# Altium project RK_NVR_DEMO1_RK3588_LP4XD200P232SD8_V21_20211228.PrjPcb (part 10 of 19)

## Sheet 40.Flash-eMMC Flash.SchDoc
size 297 x 209 mm; Revision: V2.1; Schematic Page Number: 11; Page Number: 25; Check: Default; Schematic Name: RK_NVR_DEMO1_RK3588_LP4/4x_V21; Page Count: 43; Page name: 40.Flash-eMMC Flash; Designer: Zhangdz; Schematic Page Count: 99; Revcode: V2.1; DsnPath: E:\Work\SBER\RK3588_SOM\temp\RK_NVR_DEMO1_RK3588_LP4XD200P232SD8_V21_20211228.DSN; SchematicName: RK_NVR_DEMO1_RK3588_LP4/4x_V21; PageName: 40.Flash-eMMC Flash; PageSize: A4; TopSchematic: True
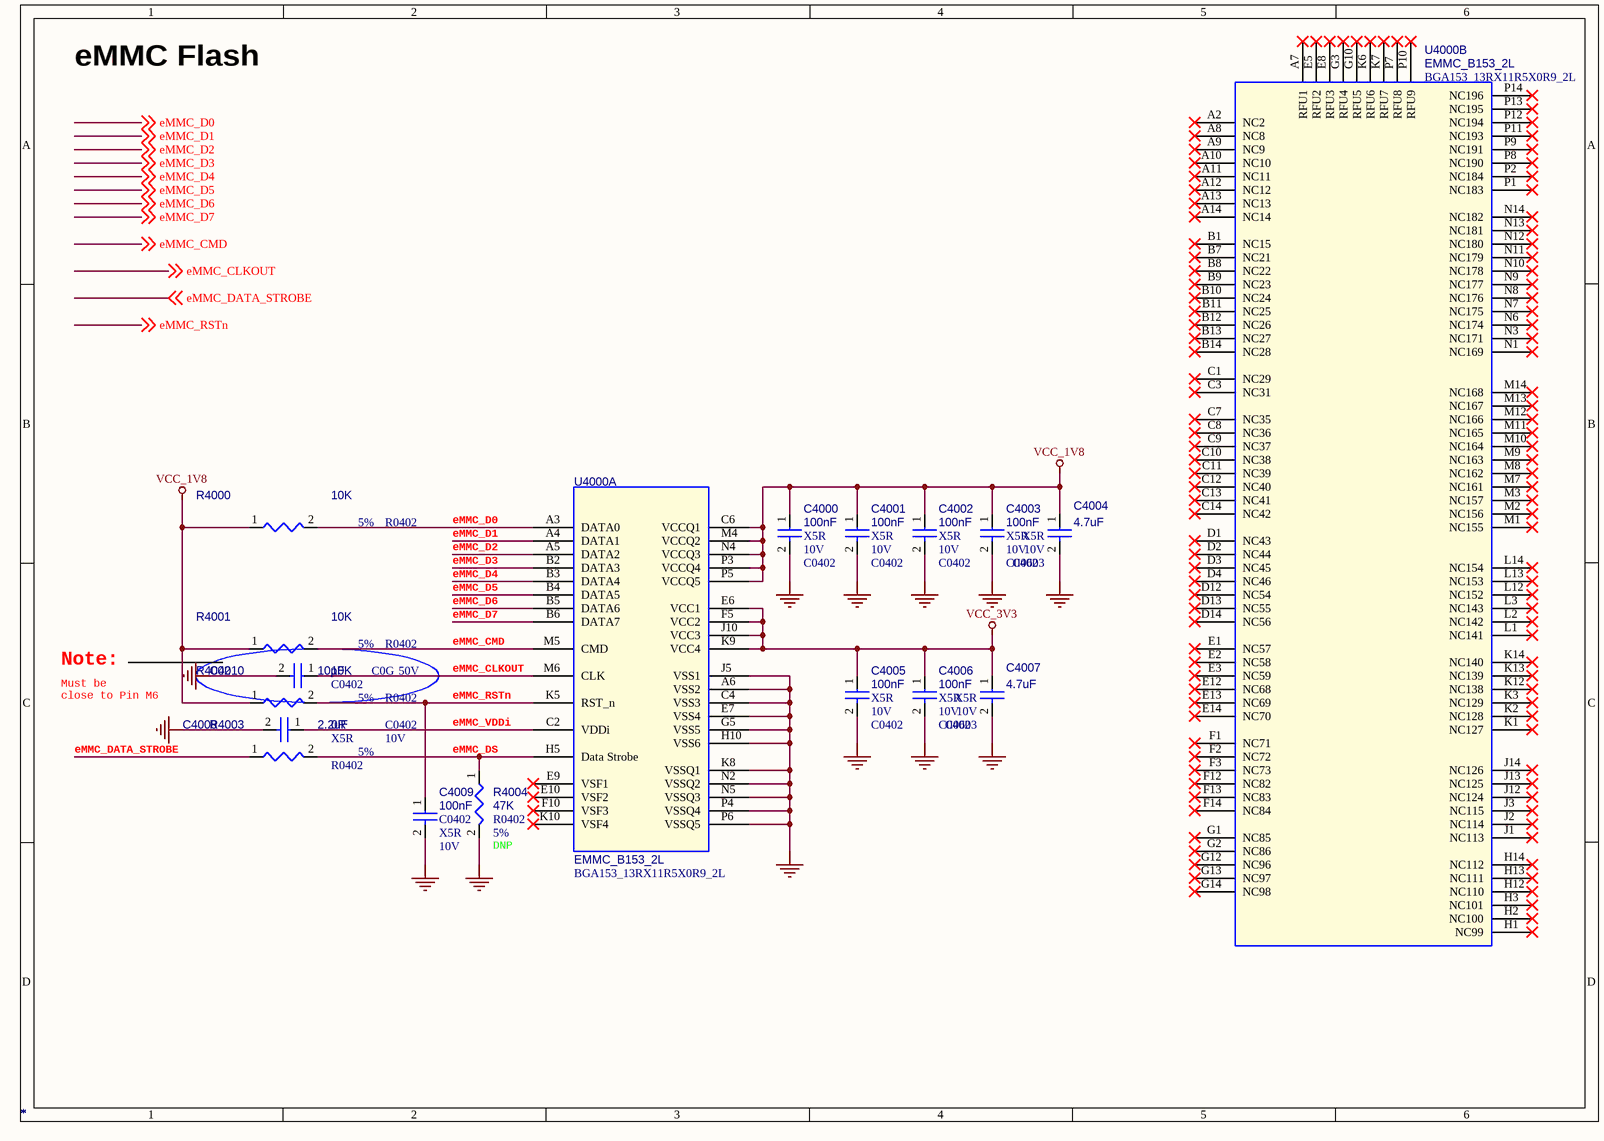
[diagram p52: 40.Flash-eMMC Flash.SchDoc]

### Parts
C4000  *  Voltage: 10V  Dielectric: X5R  [C0402]
C4001  *  Voltage: 10V  Dielectric: X5R  [C0402]
C4002  *  Voltage: 10V  Dielectric: X5R  [C0402]
C4003  *  Voltage: 10V  Dielectric: X5R  [C0402]
C4004  *  Voltage: 10V  Dielectric: X5R  [C0603]
C4005  *  Voltage: 10V  Dielectric: X5R  [C0402]
C4006  *  Voltage: 10V  Dielectric: X5R  [C0402]
C4007  *  Voltage: 10V  Dielectric: X5R  [C0603]
C4008  *  Voltage: 10V  Dielectric: X5R  [C0402]
C4009  *  Voltage: 10V  Dielectric: X5R  [C0402]
C4010  *  Voltage: 50V  Dielectric: C0G  [C0402]
R4000  *  Tolerance: 5%  [R0402]
R4001  *  Tolerance: 5%  [R0402]
R4002  *  Tolerance: 5%  [R0402]
R4003  *  Tolerance: 5%  [R0402]
R4004  *  Tolerance: 5%  option: DNP  [R0402]
U4000  *  [BGA153_13RX11R5X0R9_2L]  (parts A,B of 2)

### Nets
GND: C4000.2 C4001.2 C4002.2 C4003.2 C4004.2 C4005.2 C4006.2 C4007.2 C4008.2 C4009.2 C4010.2 R4004.2 U4000.A6(VSS2) U4000.C4(VSS3) U4000.E7(VSS4) U4000.G5(VSS5) U4000.H10(VSS6) U4000.J5(VSS1) U4000.K8(VSSQ1) U4000.N2(VSSQ2) U4000.N5(VSSQ3) U4000.P4(VSSQ4) U4000.P6(VSSQ5)
VCC_1V8: C4000.1 C4001.1 C4002.1 C4003.1 C4004.1 R4000.1 R4001.1 R4002.1 U4000.C6(VCCQ1) U4000.M4(VCCQ2) U4000.N4(VCCQ3) U4000.P3(VCCQ4) U4000.P5(VCCQ5)
VCC_3V3: C4005.1 C4006.1 C4007.1 U4000.E6(VCC1) U4000.F5(VCC2) U4000.J10(VCC3) U4000.K9(VCC4)
eMMC_CLKOUT: C4010.1 U4000.M6(CLK) ; off-sheet eMMC_CLKOUT
eMMC_CMD: R4001.2 U4000.M5(CMD) ; off-sheet eMMC_CMD
eMMC_D0: R4000.2 U4000.A3(DATA0) ; off-sheet eMMC_D0
eMMC_D1: U4000.A4(DATA1) ; off-sheet eMMC_D1
eMMC_D2: U4000.A5(DATA2) ; off-sheet eMMC_D2
eMMC_D3: U4000.B2(DATA3) ; off-sheet eMMC_D3
eMMC_D4: U4000.B3(DATA4) ; off-sheet eMMC_D4
eMMC_D5: U4000.B4(DATA5) ; off-sheet eMMC_D5
eMMC_D6: U4000.B5(DATA6) ; off-sheet eMMC_D6
eMMC_D7: U4000.B6(DATA7) ; off-sheet eMMC_D7
eMMC_DATA_STROBE: R4003.1 ; off-sheet eMMC_DATA_STROBE
eMMC_DS: R4003.2 R4004.1 U4000.H5(Data_Strobe)
eMMC_RSTn: C4009.1 R4002.2 U4000.K5(RST_n) ; off-sheet eMMC_RSTn
eMMC_VDDi: C4008.1 U4000.C2(VDDi)

Not connected (* = marked no-connect by the designer): U4000 A2(NC2)* A7(RFU1)* A8(NC8)* A9(NC9)* A10(NC10)* A11(NC11)* A12(NC12)* A13(NC13)* A14(NC14)* B1(NC15)* B7(NC21)* B8(NC22)* B9(NC23)* B10(NC24)* B11(NC25)* B12(NC26)* B13(NC27)* B14(NC28)* C1(NC29)* C3(NC31)* C7(NC35)* C8(NC36)* C9(NC37)* C10(NC38)* C11(NC39)* C12(NC40)* C13(NC41)* C14(NC42)* D1(NC43)* D2(NC44)* D3(NC45)* D4(NC46)* D12(NC54)* D13(NC55)* D14(NC56)* E1(NC57)* E2(NC58)* E3(NC59)* E5(RFU2)* E8(RFU3)* E9(VSF1)* E10(VSF2)* E12(NC68)* E13(NC69)* E14(NC70)* F1(NC71)* F2(NC72)* F3(NC73)* F10(VSF3)* F12(NC82)* F13(NC83)* F14(NC84)* G1(NC85)* G2(NC86)* G3(RFU4)* G10(RFU5)* G12(NC96)* G13(NC97)* G14(NC98)* H1(NC99)* H2(NC100)* H3(NC101)* H12(NC110)* H13(NC111)* H14(NC112)* J1(NC113)* J2(NC114)* J3(NC115)* J12(NC124)* J13(NC125)* J14(NC126)* K1(NC127)* K2(NC128)* K3(NC129)* K6(RFU6)* K7(RFU7)* K10(VSF4)* K12(NC138)* K13(NC139)* K14(NC140)* L1(NC141)* L2(NC142)* L3(NC143)* L12(NC152)* L13(NC153)* L14(NC154)* M1(NC155)* M2(NC156)* M3(NC157)* M7(NC161)* M8(NC162)* M9(NC163)* M10(NC164)* M11(NC165)* M12(NC166)* M13(NC167)* M14(NC168)* N1(NC169)* N3(NC171)* N6(NC174)* N7(NC175)* N8(NC176)* N9(NC177)* N10(NC178)* N11(NC179)* N12(NC180)* N13(NC181)* N14(NC182)* P1(NC183)* P2(NC184)* P7(RFU8)* P8(NC190)* P9(NC191)* P10(RFU9)* P11(NC193)* P12(NC194)* P13(NC195)* P14(NC196)*

### Notes on the sheet
- eMMC Flash
- Note:
- Must be
  close to Pin M6

### Library data of the parts
C4000 = CAP NP: cap,100.00nF,+/-10%,10V,X5R,C0402; Part Reference: C4000; Manufacturer: TDK; Value: 100nF; RK PN: C1005X5R1A104K050BA; Priority: A; Tolerance: 10%; PCB Footprint: C0402; Part Type: C0402; Manufacturer PN: C1005X5R1A104K050BA; Created by: JJJ
C4001 = CAP NP: cap,100.00nF,+/-10%,10V,X5R,C0402; Part Reference: C4001; Manufacturer PN: C1005X5R1A104K050BA; Manufacturer: TDK; Value: 100nF; Tolerance: 10%; Priority: A; PCB Footprint: C0402; Created by: JJJ; Part Type: C0402; RK PN: C1005X5R1A104K050BA
C4002 = CAP NP: cap,100.00nF,+/-10%,10V,X5R,C0402; Part Reference: C4002; Manufacturer PN: C1005X5R1A104K050BA; Manufacturer: TDK; Value: 100nF; Tolerance: 10%; Priority: A; PCB Footprint: C0402; Created by: JJJ; Part Type: C0402; RK PN: C1005X5R1A104K050BA
C4003 = CAP NP: cap,100.00nF,+/-10%,10V,X5R,C0402; Part Reference: C4003; Manufacturer: TDK; Value: 100nF; RK PN: C1005X5R1A104K050BA; Priority: A; Tolerance: 10%; PCB Footprint: C0402; Part Type: C0402; Manufacturer PN: C1005X5R1A104K050BA; Created by: JJJ
C4004 = CAP NP: cap,4.70uF,+/-10%,10V,X5R,C0603; Part Reference: C4004; Manufacturer: TDK; Value: 4.7uF; Number: 37; RK PN: C1608X5R1A475K080AC; Priority: A; Tolerance: 10%; C_Voltage: 6.3V; PCB Footprint: C0603; Part Type: C0603; Manufacturer PN: C1608X5R1A475K080AC; Created by: JJJ
C4005 = CAP NP: cap,100.00nF,+/-10%,10V,X5R,C0402; Part Reference: C4005; Manufacturer PN: C1005X5R1A104K050BA; Manufacturer: TDK; Value: 100nF; Tolerance: 10%; Priority: A; PCB Footprint: C0402; Created by: JJJ; Part Type: C0402; RK PN: C1005X5R1A104K050BA
C4006 = CAP NP: cap,100.00nF,+/-10%,10V,X5R,C0402; Part Reference: C4006; Manufacturer PN: C1005X5R1A104K050BA; Manufacturer: TDK; Value: 100nF; Tolerance: 10%; Priority: A; PCB Footprint: C0402; Created by: JJJ; Part Type: C0402; RK PN: C1005X5R1A104K050BA
C4007 = CAP NP: cap,4.70uF,+/-10%,10V,X5R,C0603; Part Reference: C4007; Manufacturer: TDK; Value: 4.7uF; Number: 37; RK PN: C1608X5R1A475K080AC; Priority: A; Tolerance: 10%; C_Voltage: 6.3V; PCB Footprint: C0603; Part Type: C0603; Manufacturer PN: C1608X5R1A475K080AC; Created by: JJJ
C4008 = CAP NP: cap,2.20uF,+/-10%,10V,X5R,C0402; Part Reference: C4008; Manufacturer: TDK; Value: 2.2uF; RK PN: C1005X5R1A225K050BC; Priority: A; Tolerance: 10%; PCB Footprint: C0402; Part Type: C0402; Manufacturer PN: C1005X5R1A225K050BC; Created by: JJJ
C4009 = CAP NP: cap,100.00nF,+/-10%,10V,X5R,C0402; Part Reference: C4009; Manufacturer: TDK; Value: 100nF; RK PN: C1005X5R1A104K050BA; Priority: A; Tolerance: 10%; PCB Footprint: C0402; Part Type: C0402; Manufacturer PN: C1005X5R1A104K050BA; Created by: JJJ
C4010 = CAP NP: cap,10.00pF,+/-0.5,50V,C0G,C0402; Part Reference: C4010; Manufacturer: TDK; Value: 10pF; RK PN: C1005C0G1H100D050BA; Priority: A; Tolerance: +/-0.5pF; PCB Footprint: C0402; Part Type: C0402; Manufacturer PN: C1005C0G1H100D050BA; Created by: JJJ
R4000 = RESISTOR_Dup1: НЁУГєсД¤µзЧи,10K,+/-5%,R0402,1/16W.; Part Reference: R4000; Manufacturer PN: RC0402JR-0710KL; Manufacturer: YAGEO; Wattage: 1/16W; Priority: A; PCB Footprint: R0402; Value: 10K; Created by: YTL; Part Type: НЁУГєсД¤µзЧи; RK PN: RC0402JR-0710KL
R4001 = RESISTOR_Dup1: НЁУГєсД¤µзЧи,10K,+/-5%,R0402,1/16W.; Part Reference: R4001; Manufacturer PN: RC0402JR-0710KL; Manufacturer: YAGEO; Wattage: 1/16W; Priority: A; PCB Footprint: R0402; Value: 10K; Created by: YTL; Part Type: НЁУГєсД¤µзЧи; RK PN: RC0402JR-0710KL
R4002 = RESISTOR_Dup1: НЁУГєсД¤µзЧи,10K,+/-5%,R0402,1/16W.; Part Reference: R4002; Manufacturer PN: RC0402JR-0710KL; Manufacturer: YAGEO; Wattage: 1/16W; Priority: A; PCB Footprint: R0402; Value: 10K; Created by: YTL; Part Type: НЁУГєсД¤µзЧи; RK PN: RC0402JR-0710KL
R4003 = RESISTOR_Dup1: НЁУГєсД¤µзЧи,0R,+/-5%,R0402,1/16W.; Part Reference: R4003; Manufacturer: YAGEO; RK PN: RC0402JR-070RL; Priority: A; Wattage: 1/16W; PCB Footprint: R0402; Value: 0R; Part Type: НЁУГєсД¤µзЧи; Manufacturer PN: RC0402JR-070RL; Created by: YTL
R4004 = RESISTOR_Dup1: НЁУГєсД¤µзЧи,47K,+/-5%,R0402,1/16W.; Part Reference: R4004; Manufacturer: YAGEO; RK PN: RC0402JR-0747KL; Priority: A; Wattage: 1/16W; PCB Footprint: R0402; Value: 47K; Part Type: НЁУГєсД¤µзЧи; Manufacturer PN: RC0402JR-0747KL; Created by: YTL
U4000 = INAND_EMMC_153_2L: EMMC_B153_2L,ёьєГµДВъЧг№¤ТХРиЗуЈ¬Fanout·ЅКЅІї·ЦЧЯПЯїзЅУФЩЗтО»ЙПЈ¬НЪіэA1\C5ЗтО»; Part Reference: U4000; Priority: A; PCB Footprint: BGA153_13RX11R5X0R9_2L; Value: EMMC_B153_2L; RK PN: EMMC_B153_2L; Part Type: NAND_FLASH; Created by: YWQ

## Sheet 43.Flash-SPI FLASH(Option).SchDoc
size 297 x 209 mm; Revision: V2.1; Schematic Page Number: 11; Page Number: 26; Check: Default; Schematic Name: RK_NVR_DEMO1_RK3588_LP4/4x_V21; Page Count: 43; Page name: 43.Flash-SPI FLASH(Option); Designer: Zhangdz; Schematic Page Count: 99; Revcode: V2.1; DsnPath: E:\Work\SBER\RK3588_SOM\temp\RK_NVR_DEMO1_RK3588_LP4XD200P232SD8_V21_20211228.DSN; SchematicName: RK_NVR_DEMO1_RK3588_LP4/4x_V21; PageName: 43.Flash-SPI FLASH(Option); PageSize: A4; TopSchematic: True
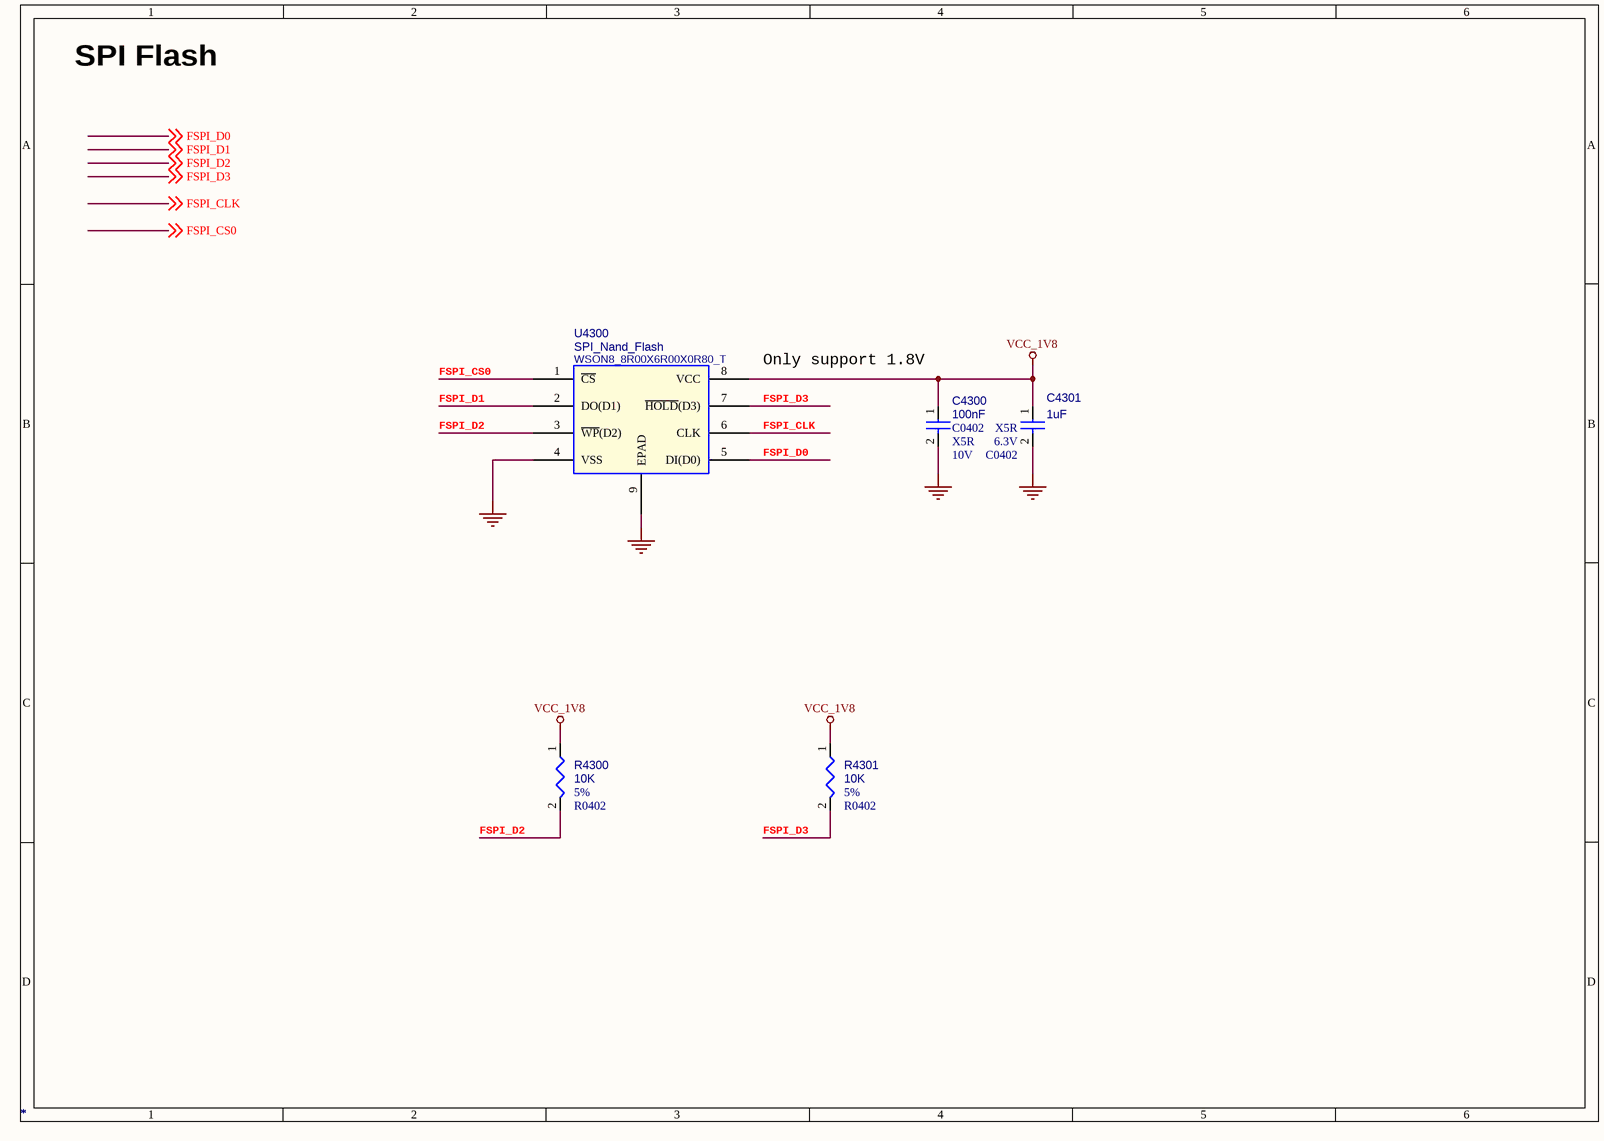
[diagram p53: 43.Flash-SPI FLASH(Option).SchDoc]

### Parts
C4300  *  Voltage: 10V  Dielectric: X5R  [C0402]
C4301  *  Voltage: 6.3V  Dielectric: X5R  [C0402]
R4300  *  Tolerance: 5%  [R0402]
R4301  *  Tolerance: 5%  [R0402]
U4300  *  [WSON8_8R00X6R00X0R80_T]

### Nets
GND: C4300.2 C4301.2 U4300.4(VSS) U4300.9(EPAD)
VCC_1V8: C4300.1 C4301.1 R4300.1 R4301.1 U4300.8(VCC)
FSPI_CLK: U4300.6(CLK) ; off-sheet FSPI_CLK
FSPI_CS0: U4300.1(~{CS}) ; off-sheet FSPI_CS0
FSPI_D0: U4300.5(DI(D0)) ; off-sheet FSPI_D0
FSPI_D1: U4300.2(DO(D1)) ; off-sheet FSPI_D1
FSPI_D2: R4300.2 U4300.3(~{WP}(D2)) ; off-sheet FSPI_D2
FSPI_D3: R4301.2 U4300.7(~{HOLD}(D3)) ; off-sheet FSPI_D3

### Notes on the sheet
- SPI Flash
- Only support 1.8V

### Library data of the parts
C4300 = CAP NP: cap,100.00nF,+/-10%,10V,X5R,C0402; Part Reference: C4300; Manufacturer: TDK; Value: 100nF; RK PN: C1005X5R1A104K050BA; Priority: A; Tolerance: 10%; PCB Footprint: C0402; Part Type: C0402; Manufacturer PN: C1005X5R1A104K050BA; Created by: JJJ
C4301 = CAP NP: cap,1.00uF,+/-10%,6.3V,X5R,C0402; Part Reference: C4301; Manufacturer: TDK; Value: 1uF; Number: 37; RK PN: C1005X5R0J105K050BB; Priority: A; Tolerance: 10%; PCB Footprint: C0402; Part Type: C0402; Manufacturer PN: C1005X5R0J105K050BB; C_Voltage: 6.3V; Created by: JJJ
R4300 = RESISTOR_Dup1: НЁУГєсД¤µзЧи,10K,+/-5%,R0402,1/16W.; Part Reference: R4300; Manufacturer PN: RC0402JR-0710KL; Manufacturer: YAGEO; Priority: A; Wattage: 1/16W; PCB Footprint: R0402; Value: 10K; Created by: YTL; Part Type: НЁУГєсД¤µзЧи; RK PN: RC0402JR-0710KL
R4301 = RESISTOR_Dup1: НЁУГєсД¤µзЧи,10K,+/-5%,R0402,1/16W.; Part Reference: R4301; Manufacturer: YAGEO; Wattage: 1/16W; RK PN: RC0402JR-0710KL; Priority: A; PCB Footprint: R0402; Value: 10K; Part Type: НЁУГєсД¤µзЧи; Manufacturer PN: RC0402JR-0710KL; Created by: YTL
U4300 = SPI_FLASH_8PIN_T_0: Part Reference: U4300; Value: SPI_Nand_Flash; Priority: A; PCB Footprint: WSON8_8R00X6R00X0R80_T; Part Type: SPI_FLASH; Created by: JJJ

## Sheet 47.VI-Camera_MIPI-CSI.SchDoc
size 297 x 209 mm; Revision: V2.1; Schematic Page Number: 11; Page Number: 27; Check: <Checker>; Schematic Name: RK_NVR_DEMO1_RK3588_LP4/4x_V21; Page Count: 43; Page name: 47.VI-Camera_MIPI-CSI; Designer: Zhangdz; Schematic Page Count: 99; Revcode: V2.1; DsnPath: E:\Work\SBER\RK3588_SOM\temp\RK_NVR_DEMO1_RK3588_LP4XD200P232SD8_V21_20211228.DSN; SchematicName: RK_NVR_DEMO1_RK3588_LP4/4x_V21; PageName: 47.VI-Camera_MIPI-CSI; PageSize: A4; TopSchematic: True
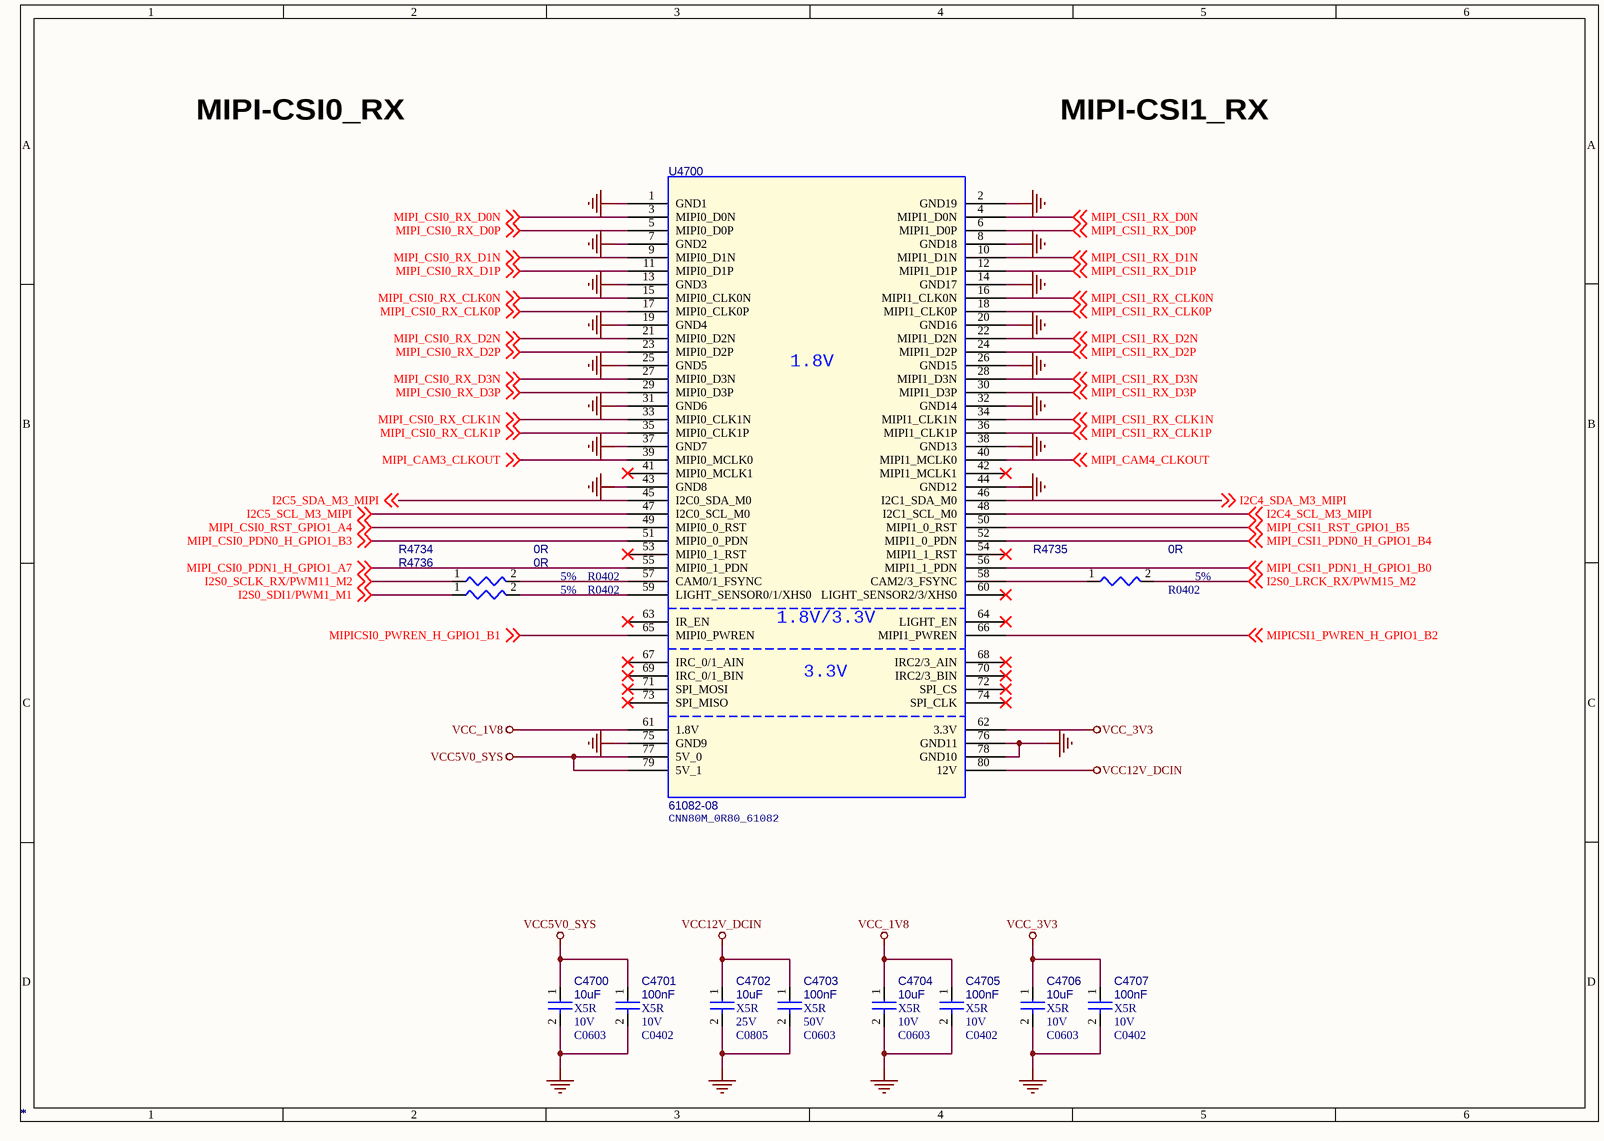
[diagram p54: 47.VI-Camera_MIPI-CSI.SchDoc]

### Parts
C4700  *  Voltage: 10V  Dielectric: X5R  [C0603]
C4701  *  Voltage: 10V  Dielectric: X5R  [C0402]
C4702  *  Voltage: 25V  Dielectric: X5R  [C0805]
C4703  *  Voltage: 50V  Dielectric: X5R  [C0603]
C4704  *  Voltage: 10V  Dielectric: X5R  [C0603]
C4705  *  Voltage: 10V  Dielectric: X5R  [C0402]
C4706  *  Voltage: 10V  Dielectric: X5R  [C0603]
C4707  *  Voltage: 10V  Dielectric: X5R  [C0402]
R4734  *  Tolerance: 5%  [R0402]
R4735  *  Tolerance: 5%  [R0402]
R4736  *  Tolerance: 5%  [R0402]
U4700  *  [CNN80M_0R80_61082]

### Nets
GND: C4700.2 C4701.2 C4702.2 C4703.2 C4704.2 C4705.2 C4706.2 C4707.2 U4700.1(GND1) U4700.2(GND19) U4700.7(GND2) U4700.8(GND18) U4700.13(GND3) U4700.14(GND17) U4700.19(GND4) U4700.20(GND16) U4700.25(GND5) U4700.26(GND15) U4700.31(GND6) U4700.32(GND14) U4700.37(GND7) U4700.38(GND13) U4700.43(GND8) U4700.44(GND12) U4700.75(GND9) U4700.76(GND11) U4700.78(GND10)
VCC5V0_SYS: C4700.1 C4701.1 U4700.77(5V_0) U4700.79(5V_1)
VCC12V_DCIN: C4702.1 C4703.1 U4700.80(12V)
VCC_1V8: C4704.1 C4705.1 U4700.61(1.8V)
VCC_3V3: C4706.1 C4707.1 U4700.62(3.3V)
I2C4_SCL_M3_MIPI: U4700.48(I2C1_SCL_M0) ; off-sheet I2C4_SCL_M3_MIPI
I2C4_SDA_M3_MIPI: U4700.46(I2C1_SDA_M0) ; off-sheet I2C4_SDA_M3_MIPI
I2C5_SCL_M3_MIPI: U4700.47(I2C0_SCL_M0) ; off-sheet I2C5_SCL_M3_MIPI
I2C5_SDA_M3_MIPI: U4700.45(I2C0_SDA_M0) ; off-sheet I2C5_SDA_M3_MIPI
I2S0_LRCK_RX/PWM15_M2: R4735.2 ; off-sheet I2S0_LRCK_RX/PWM15_M2
I2S0_SCLK_RX/PWM11_M2: R4734.1 ; off-sheet I2S0_SCLK_RX/PWM11_M2
I2S0_SDI1/PWM1_M1: R4736.1 ; off-sheet I2S0_SDI1/PWM1_M1
MIPI_CAM3_CLKOUT: U4700.39(MIPI0_MCLK0) ; off-sheet MIPI_CAM3_CLKOUT
MIPI_CAM4_CLKOUT: U4700.40(MIPI1_MCLK0) ; off-sheet MIPI_CAM4_CLKOUT
MIPI_CSI0_PDN0_H_GPIO1_B3: U4700.51(MIPI0_0_PDN) ; off-sheet MIPI_CSI0_PDN0_H_GPIO1_B3
MIPI_CSI0_PDN1_H_GPIO1_A7: U4700.55(MIPI0_1_PDN) ; off-sheet MIPI_CSI0_PDN1_H_GPIO1_A7
MIPI_CSI0_RST_GPIO1_A4: U4700.49(MIPI0_0_RST) ; off-sheet MIPI_CSI0_RST_GPIO1_A4
MIPI_CSI0_RX_CLK0N: U4700.15(MIPI0_CLK0N) ; off-sheet MIPI_CSI0_RX_CLK0N
MIPI_CSI0_RX_CLK0P: U4700.17(MIPI0_CLK0P) ; off-sheet MIPI_CSI0_RX_CLK0P
MIPI_CSI0_RX_CLK1N: U4700.33(MIPI0_CLK1N) ; off-sheet MIPI_CSI0_RX_CLK1N
MIPI_CSI0_RX_CLK1P: U4700.35(MIPI0_CLK1P) ; off-sheet MIPI_CSI0_RX_CLK1P
MIPI_CSI0_RX_D0N: U4700.3(MIPI0_D0N) ; off-sheet MIPI_CSI0_RX_D0N
MIPI_CSI0_RX_D0P: U4700.5(MIPI0_D0P) ; off-sheet MIPI_CSI0_RX_D0P
MIPI_CSI0_RX_D1N: U4700.9(MIPI0_D1N) ; off-sheet MIPI_CSI0_RX_D1N
MIPI_CSI0_RX_D1P: U4700.11(MIPI0_D1P) ; off-sheet MIPI_CSI0_RX_D1P
MIPI_CSI0_RX_D2N: U4700.21(MIPI0_D2N) ; off-sheet MIPI_CSI0_RX_D2N
MIPI_CSI0_RX_D2P: U4700.23(MIPI0_D2P) ; off-sheet MIPI_CSI0_RX_D2P
MIPI_CSI0_RX_D3N: U4700.27(MIPI0_D3N) ; off-sheet MIPI_CSI0_RX_D3N
MIPI_CSI0_RX_D3P: U4700.29(MIPI0_D3P) ; off-sheet MIPI_CSI0_RX_D3P
MIPI_CSI1_PDN0_H_GPIO1_B4: U4700.52(MIPI1_0_PDN) ; off-sheet MIPI_CSI1_PDN0_H_GPIO1_B4
MIPI_CSI1_PDN1_H_GPIO1_B0: U4700.56(MIPI1_1_PDN) ; off-sheet MIPI_CSI1_PDN1_H_GPIO1_B0
MIPI_CSI1_RST_GPIO1_B5: U4700.50(MIPI1_0_RST) ; off-sheet MIPI_CSI1_RST_GPIO1_B5
MIPI_CSI1_RX_CLK0N: U4700.16(MIPI1_CLK0N) ; off-sheet MIPI_CSI1_RX_CLK0N
MIPI_CSI1_RX_CLK0P: U4700.18(MIPI1_CLK0P) ; off-sheet MIPI_CSI1_RX_CLK0P
MIPI_CSI1_RX_CLK1N: U4700.34(MIPI1_CLK1N) ; off-sheet MIPI_CSI1_RX_CLK1N
MIPI_CSI1_RX_CLK1P: U4700.36(MIPI1_CLK1P) ; off-sheet MIPI_CSI1_RX_CLK1P
MIPI_CSI1_RX_D0N: U4700.4(MIPI1_D0N) ; off-sheet MIPI_CSI1_RX_D0N
MIPI_CSI1_RX_D0P: U4700.6(MIPI1_D0P) ; off-sheet MIPI_CSI1_RX_D0P
MIPI_CSI1_RX_D1N: U4700.10(MIPI1_D1N) ; off-sheet MIPI_CSI1_RX_D1N
MIPI_CSI1_RX_D1P: U4700.12(MIPI1_D1P) ; off-sheet MIPI_CSI1_RX_D1P
MIPI_CSI1_RX_D2N: U4700.22(MIPI1_D2N) ; off-sheet MIPI_CSI1_RX_D2N
MIPI_CSI1_RX_D2P: U4700.24(MIPI1_D2P) ; off-sheet MIPI_CSI1_RX_D2P
MIPI_CSI1_RX_D3N: U4700.28(MIPI1_D3N) ; off-sheet MIPI_CSI1_RX_D3N
MIPI_CSI1_RX_D3P: U4700.30(MIPI1_D3P) ; off-sheet MIPI_CSI1_RX_D3P
MIPICSI0_PWREN_H_GPIO1_B1: U4700.65(MIPI0_PWREN) ; off-sheet MIPICSI0_PWREN_H_GPIO1_B1
MIPICSI1_PWREN_H_GPIO1_B2: U4700.66(MIPI1_PWREN) ; off-sheet MIPICSI1_PWREN_H_GPIO1_B2
NetR4734_2: R4734.2 U4700.57(CAM0/1_FSYNC)
NetR4735_1: R4735.1 U4700.58(CAM2/3_FSYNC)
NetR4736_2: R4736.2 U4700.59(LIGHT_SENSOR0/1/XHS0)

Not connected (* = marked no-connect by the designer): U4700 41(MIPI0_MCLK1)* 42(MIPI1_MCLK1)* 53(MIPI0_1_RST)* 54(MIPI1_1_RST)* 60(LIGHT_SENSOR2/3/XHS0)* 63(IR_EN)* 64(LIGHT_EN)* 67(IRC_0/1_AIN)* 68(IRC2/3_AIN)* 69(IRC_0/1_BIN)* 70(IRC2/3_BIN)* 71(SPI_MOSI)* 72(SPI_CS)* 73(SPI_MISO)* 74(SPI_CLK)*

### Notes on the sheet
- MIPI-CSI0_RX
- MIPI-CSI1_RX
- (in symbol 61082-08) 1.8V/3.3V

### Library data of the parts
C4700 = CAP NP: cap,10.00uF,+/-10%,10V,X5R,C0603; Part Reference: C4700; Manufacturer: TDK; Value: 10uF; RK PN: C1608X5R1A106K080AC; Priority: A; Tolerance: 10%; PCB Footprint: C0603; Part Type: C0603; Manufacturer PN: C1608X5R1A106K080AC; Created by: JJJ
C4701 = CAP NP: cap,100.00nF,+/-10%,10V,X5R,C0402; Part Reference: C4701; Manufacturer PN: C1005X5R1A104K050BA; Manufacturer: TDK; Value: 100nF; Tolerance: 10%; Priority: A; PCB Footprint: C0402; Created by: JJJ; Part Type: C0402; RK PN: C1005X5R1A104K050BA
C4702 = CAP NP: cap,10.00uF,+/-10%,25V,X5R,C0805; Part Reference: C4702; Manufacturer: TDK; Value: 10uF; RK PN: C2012X5R1E106K085AC; Priority: A; Tolerance: 10%; PCB Footprint: C0805; Part Type: C0805; Manufacturer PN: C2012X5R1E106K085AC; Created by: JJJ
C4703 = CAP NP: cap,100.00nF,+/-10%,50V,X5R,C0603; Part Reference: C4703; Manufacturer PN: C1608X5R1H104K080AA; Manufacturer: TDK; Value: 100nF; Tolerance: 10%; Priority: A; PCB Footprint: C0603; Created by: JJJ; Part Type: C0603; RK PN: C1608X5R1H104K080AA
C4704 = CAP NP: cap,10.00uF,+/-10%,10V,X5R,C0603; Part Reference: C4704; Manufacturer: TDK; Value: 10uF; RK PN: C1608X5R1A106K080AC; Priority: A; Tolerance: 10%; PCB Footprint: C0603; Part Type: C0603; Manufacturer PN: C1608X5R1A106K080AC; Created by: JJJ
C4705 = CAP NP: cap,100.00nF,+/-10%,10V,X5R,C0402; Part Reference: C4705; Manufacturer PN: C1005X5R1A104K050BA; Manufacturer: TDK; Value: 100nF; Tolerance: 10%; Priority: A; PCB Footprint: C0402; Created by: JJJ; Part Type: C0402; RK PN: C1005X5R1A104K050BA
C4706 = CAP NP: cap,10.00uF,+/-10%,10V,X5R,C0603; Part Reference: C4706; Manufacturer: TDK; Value: 10uF; RK PN: C1608X5R1A106K080AC; Priority: A; Tolerance: 10%; PCB Footprint: C0603; Part Type: C0603; Manufacturer PN: C1608X5R1A106K080AC; Created by: JJJ
C4707 = CAP NP: cap,100.00nF,+/-10%,10V,X5R,C0402; Part Reference: C4707; Manufacturer: TDK; Value: 100nF; RK PN: C1005X5R1A104K050BA; Priority: A; Tolerance: 10%; PCB Footprint: C0402; Part Type: C0402; Manufacturer PN: C1005X5R1A104K050BA; Created by: JJJ
R4734 = RESISTOR_Dup1: НЁУГєсД¤µзЧи,0R,+/-5%,R0402,1/16W.; Part Reference: R4734; Manufacturer: YAGEO; RK PN: RC0402JR-070RL; Priority: A; Wattage: 1/16W; PCB Footprint: R0402; Value: 0R; Part Type: НЁУГєсД¤µзЧи; Manufacturer PN: RC0402JR-070RL; Created by: YTL
R4735 = RESISTOR_Dup1: НЁУГєсД¤µзЧи,0R,+/-5%,R0402,1/16W.; Part Reference: R4735; Manufacturer: YAGEO; RK PN: RC0402JR-070RL; Priority: A; Wattage: 1/16W; PCB Footprint: R0402; Value: 0R; Part Type: НЁУГєсД¤µзЧи; Manufacturer PN: RC0402JR-070RL; Created by: YTL
R4736 = RESISTOR_Dup1: НЁУГєсД¤µзЧи,0R,+/-5%,R0402,1/16W.; Part Reference: R4736; Manufacturer PN: RC0402JR-070RL; Manufacturer: YAGEO; Wattage: 1/16W; Priority: A; PCB Footprint: R0402; Value: 0R; Created by: YTL; Part Type: НЁУГєсД¤µзЧи; RK PN: RC0402JR-070RL
U4700 = 61082-08: Part Reference: U4700; Value: 61082-08; PCB Footprint: CNN80M_0R80_61082

## Sheet 50.VO-HDMI2.1 TX.SchDoc
size 420 x 297 mm; Revision: V2.1; Schematic Page Number: 11; Page Number: 28; Check: <Checker>; Schematic Name: RK_NVR_DEMO1_RK3588_LP4/4x_V21; Page Count: 43; Page name: 50.VO-HDMI2.1 TX; Designer: Zhangdz; Schematic Page Count: 99; Revcode: V2.1; DsnPath: E:\Work\SBER\RK3588_SOM\temp\RK_NVR_DEMO1_RK3588_LP4XD200P232SD8_V21_20211228.DSN; SchematicName: RK_NVR_DEMO1_RK3588_LP4/4x_V21; PageName: 50.VO-HDMI2.1 TX; PageSize: A3; TopSchematic: True
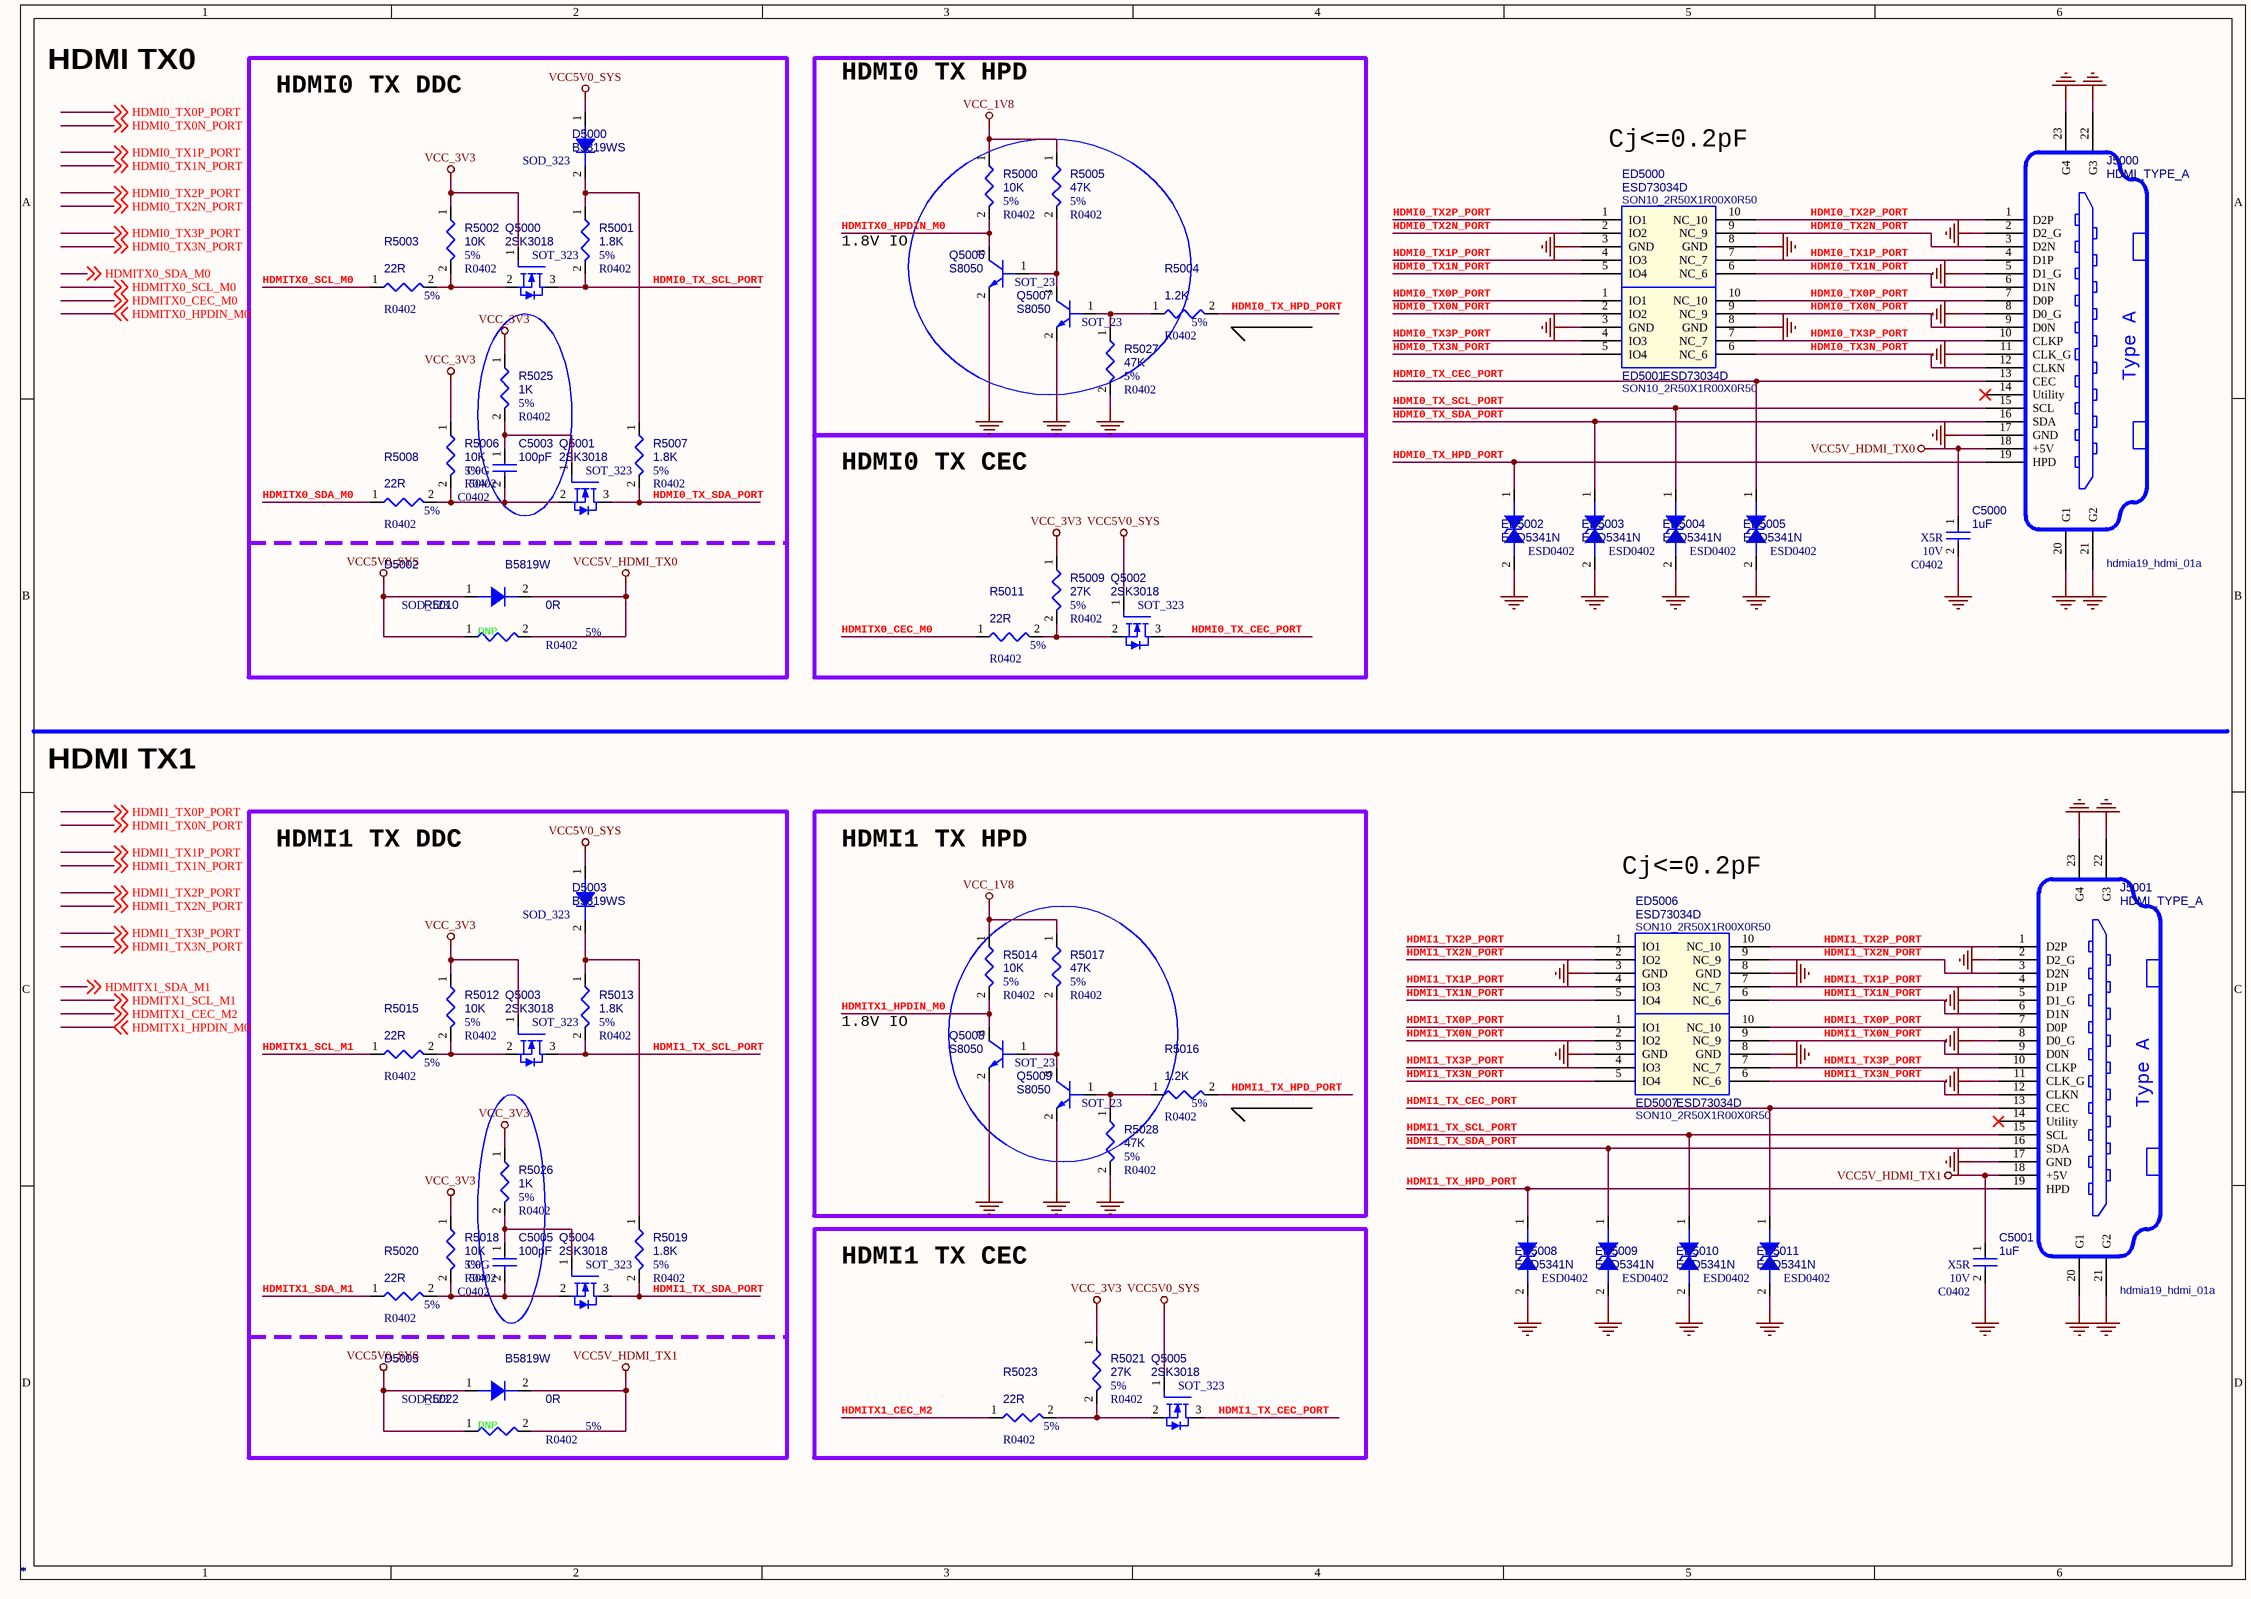
[diagram p55: 50.VO-HDMI2.1 TX.SchDoc]

### Parts
C5000  *  Voltage: 10V  Dielectric: X5R  [C0402]
C5001  *  Voltage: 10V  Dielectric: X5R  [C0402]
C5003  *  Voltage: 50V  Dielectric: C0G  [C0402]
C5005  *  Voltage: 50V  Dielectric: C0G  [C0402]
D5000  *  [SOD_323]
D5002  *  [SOD_123]
D5003  *  [SOD_323]
D5005  *  [SOD_123]
ED5000  *  [SON10_2R50X1R00X0R50]
ED5001  *  [SON10_2R50X1R00X0R50]
ED5002  *  [ESD0402]
ED5003  *  [ESD0402]
ED5004  *  [ESD0402]
ED5005  *  [ESD0402]
ED5006  *  [SON10_2R50X1R00X0R50]
ED5007  *  [SON10_2R50X1R00X0R50]
ED5008  *  [ESD0402]
ED5009  *  [ESD0402]
ED5010  *  [ESD0402]
ED5011  *  [ESD0402]
J5000  *  [hdmia19_hdmi_01a]
J5001  *  [hdmia19_hdmi_01a]
Q5000  *  PCB Footprint: SOT_323  [SOT23]
Q5001  *  PCB Footprint: SOT_323  [SOT23]
Q5002  *  PCB Footprint: SOT_323  [SOT23]
Q5003  *  PCB Footprint: SOT_323  [SOT23]
Q5004  *  PCB Footprint: SOT_323  [SOT23]
Q5005  *  PCB Footprint: SOT_323  [SOT23]
Q5006  *  [SOT_23]
Q5007  *  [SOT_23]
Q5008  *  [SOT_23]
Q5009  *  [SOT_23]
R5000  *  Tolerance: 5%  [R0402]
R5001  *  Tolerance: 5%  [R0402]
R5002  *  Tolerance: 5%  [R0402]
R5003  *  Tolerance: 5%  [R0402]
R5004  *  Tolerance: 5%  [R0402]
R5005  *  Tolerance: 5%  [R0402]
R5006  *  Tolerance: 5%  [R0402]
R5007  *  Tolerance: 5%  [R0402]
R5008  *  Tolerance: 5%  [R0402]
R5009  *  Tolerance: 5%  [R0402]
R5010  *  Tolerance: 5%  Option: DNP  [R0402]
R5011  *  Tolerance: 5%  [R0402]
R5012  *  Tolerance: 5%  [R0402]
R5013  *  Tolerance: 5%  [R0402]
R5014  *  Tolerance: 5%  [R0402]
R5015  *  Tolerance: 5%  [R0402]
R5016  *  Tolerance: 5%  [R0402]
R5017  *  Tolerance: 5%  [R0402]
R5018  *  Tolerance: 5%  [R0402]
R5019  *  Tolerance: 5%  [R0402]
R5020  *  Tolerance: 5%  [R0402]
R5021  *  Tolerance: 5%  [R0402]
R5022  *  Tolerance: 5%  Option: DNP  [R0402]
R5023  *  Tolerance: 5%  [R0402]
R5025  *  Tolerance: 5%  [R0402]
R5026  *  Tolerance: 5%  [R0402]
R5027  *  Tolerance: 5%  [R0402]
R5028  *  Tolerance: 5%  [R0402]

### Blocks framed on the sheet
HDMI0 TX DDC: C5003 D5000 D5002 Q5000 Q5001 R5001-R5003 R5006-R5008 R5010 R5025
HDMI0 TX HPD: Q5006 Q5007 R5000 R5004 R5005 R5027
HDMI0 TX CEC: Q5002 R5009 R5011
HDMI1 TX DDC: C5005 D5003 D5005 Q5003 Q5004 R5012 R5013 R5015 R5018-R5020 R5022 R5026
HDMI1 TX HPD: Q5008 Q5009 R5014 R5016 R5017 R5028
HDMI1 TX CEC: Q5005 R5021 R5023

### Nets
GND: C5000.2 C5001.2 ED5000.3(GND) ED5000.8(GND) ED5001.3(GND) ED5001.8(GND) ED5002.2 ED5003.2 ED5004.2 ED5005.2 ED5006.3(GND) ED5006.8(GND) ED5007.3(GND) ED5007.8(GND) ED5008.2 ED5009.2 ED5010.2 ED5011.2 J5000.2(D2_G) J5000.5(D1_G) J5000.8(D0_G) J5000.11(CLK_G) J5000.17(GND) J5000.20(G1) J5000.21(G2) J5000.22(G3) J5000.23(G4) J5001.2(D2_G) J5001.5(D1_G) J5001.8(D0_G) J5001.11(CLK_G) J5001.17(GND) J5001.20(G1) J5001.21(G2) J5001.22(G3) J5001.23(G4) Q5006.2(EMITTER) Q5007.2(EMITTER) Q5008.2(EMITTER) Q5009.2(EMITTER) R5027.2 R5028.2
VCC5V0_SYS: D5000.1(A) D5002.1(A) D5003.1(A) D5005.1(A) Q5002.1(GATE) Q5005.1(GATE) R5010.1 R5022.1
VCC5V_HDMI_TX0: C5000.1 D5002.2(K) J5000.18(+5V) R5010.2
VCC5V_HDMI_TX1: C5001.1 D5005.2(K) J5001.18(+5V) R5022.2
VCC_1V8: R5000.1 R5005.1 R5014.1 R5017.1
VCC_3V3: Q5000.1(GATE) Q5003.1(GATE) R5002.1 R5006.1 R5009.1 R5012.1 R5018.1 R5021.1 R5025.1 R5026.1
HDMI0_TX0N_PORT: ED5001.2(IO2) ED5001.9(NC_9) J5000.9(D0N) ; off-sheet HDMI0_TX0N_PORT
HDMI0_TX0P_PORT: ED5001.1(IO1) ED5001.10(NC_10) J5000.7(D0P) ; off-sheet HDMI0_TX0P_PORT
HDMI0_TX1N_PORT: ED5000.5(IO4) ED5000.6(NC_6) J5000.6(D1N) ; off-sheet HDMI0_TX1N_PORT
HDMI0_TX1P_PORT: ED5000.4(IO3) ED5000.7(NC_7) J5000.4(D1P) ; off-sheet HDMI0_TX1P_PORT
HDMI0_TX2N_PORT: ED5000.2(IO2) ED5000.9(NC_9) J5000.3(D2N) ; off-sheet HDMI0_TX2N_PORT
HDMI0_TX2P_PORT: ED5000.1(IO1) ED5000.10(NC_10) J5000.1(D2P) ; off-sheet HDMI0_TX2P_PORT
HDMI0_TX3N_PORT: ED5001.5(IO4) ED5001.6(NC_6) J5000.12(CLKN) ; off-sheet HDMI0_TX3N_PORT
HDMI0_TX3P_PORT: ED5001.4(IO3) ED5001.7(NC_7) J5000.10(CLKP) ; off-sheet HDMI0_TX3P_PORT
HDMI0_TX_CEC_PORT: ED5005.1 J5000.13(CEC) Q5002.3(DRAIN)
HDMI0_TX_HPD_PORT: ED5002.1 J5000.19(HPD) R5004.2
HDMI0_TX_SCL_PORT: ED5004.1 J5000.15(SCL) Q5000.3(DRAIN) R5001.2
HDMI0_TX_SDA_PORT: ED5003.1 J5000.16(SDA) Q5001.3(DRAIN) R5007.2
HDMI1_TX0N_PORT: ED5007.2(IO2) ED5007.9(NC_9) J5001.9(D0N) ; off-sheet HDMI1_TX0N_PORT
HDMI1_TX0P_PORT: ED5007.1(IO1) ED5007.10(NC_10) J5001.7(D0P) ; off-sheet HDMI1_TX0P_PORT
HDMI1_TX1N_PORT: ED5006.5(IO4) ED5006.6(NC_6) J5001.6(D1N) ; off-sheet HDMI1_TX1N_PORT
HDMI1_TX1P_PORT: ED5006.4(IO3) ED5006.7(NC_7) J5001.4(D1P) ; off-sheet HDMI1_TX1P_PORT
HDMI1_TX2N_PORT: ED5006.2(IO2) ED5006.9(NC_9) J5001.3(D2N) ; off-sheet HDMI1_TX2N_PORT
HDMI1_TX2P_PORT: ED5006.1(IO1) ED5006.10(NC_10) J5001.1(D2P) ; off-sheet HDMI1_TX2P_PORT
HDMI1_TX3N_PORT: ED5007.5(IO4) ED5007.6(NC_6) J5001.12(CLKN) ; off-sheet HDMI1_TX3N_PORT
HDMI1_TX3P_PORT: ED5007.4(IO3) ED5007.7(NC_7) J5001.10(CLKP) ; off-sheet HDMI1_TX3P_PORT
HDMI1_TX_CEC_PORT: ED5011.1 J5001.13(CEC) Q5005.3(DRAIN)
HDMI1_TX_HPD_PORT: ED5008.1 J5001.19(HPD) R5016.2
HDMI1_TX_SCL_PORT: ED5010.1 J5001.15(SCL) Q5003.3(DRAIN) R5013.2
HDMI1_TX_SDA_PORT: ED5009.1 J5001.16(SDA) Q5004.3(DRAIN) R5019.2
HDMITX0_CEC_M0: R5011.1 ; off-sheet HDMITX0_CEC_M0
HDMITX0_HPDIN_M0: Q5006.3(COLLECTOR) R5000.2 ; off-sheet HDMITX0_HPDIN_M0
HDMITX0_SCL_M0: R5003.1 ; off-sheet HDMITX0_SCL_M0
HDMITX0_SDA_M0: R5008.1 ; off-sheet HDMITX0_SDA_M0
HDMITX1_CEC_M2: R5023.1 ; off-sheet HDMITX1_CEC_M2
HDMITX1_HPDIN_M0: Q5008.3(COLLECTOR) R5014.2 ; off-sheet HDMITX1_HPDIN_M0
HDMITX1_SCL_M1: R5015.1 ; off-sheet HDMITX1_SCL_M1
HDMITX1_SDA_M1: R5020.1 ; off-sheet HDMITX1_SDA_M1
NetC5003_1: C5003.1 Q5001.1(GATE) R5025.2
NetC5003_2: C5003.2 Q5001.2(SOURCE) R5006.2 R5008.2
NetC5005_1: C5005.1 Q5004.1(GATE) R5026.2
NetC5005_2: C5005.2 Q5004.2(SOURCE) R5018.2 R5020.2
NetD5000_2: D5000.2(K) R5001.1 R5007.1
NetD5003_2: D5003.2(K) R5013.1 R5019.1
NetQ5000_2: Q5000.2(SOURCE) R5002.2 R5003.2
NetQ5002_2: Q5002.2(SOURCE) R5009.2 R5011.2
NetQ5003_2: Q5003.2(SOURCE) R5012.2 R5015.2
NetQ5005_2: Q5005.2(SOURCE) R5021.2 R5023.2
NetQ5006_1: Q5006.1(BASE) Q5007.3(COLLECTOR) R5005.2
NetQ5007_1: Q5007.1(BASE) R5004.1 R5027.1
NetQ5008_1: Q5008.1(BASE) Q5009.3(COLLECTOR) R5017.2
NetQ5009_1: Q5009.1(BASE) R5016.1 R5028.1

Not connected (* = marked no-connect by the designer): J5000 14(Utility)*; J5001 14(Utility)*

### Notes on the sheet
- HDMI TX0
- Cj<=0.2pF
- 1.8V IO
- HDMI TX1
- (in symbol HDMI_TYPE_A_0) Type A

### Library data of the parts
C5000 = CAP NP: cap,1.00uF,+/-10%,10V,X5R,C0402; Part Reference: C5000; Manufacturer PN: C1005X5R1A105K050BB; Manufacturer: TDK; Value: 1uF; Tolerance: 10%; Priority: A; Number: 37; PCB Footprint: C0402; Created by: JJJ; C_Voltage: 10V; Part Type: C0402; RK PN: C1005X5R1A105K050BB
C5001 = CAP NP: cap,1.00uF,+/-10%,10V,X5R,C0402; Part Reference: C5001; Manufacturer PN: C1005X5R1A105K050BB; Manufacturer: TDK; Value: 1uF; Tolerance: 10%; Priority: A; Number: 37; PCB Footprint: C0402; Created by: JJJ; C_Voltage: 10V; Part Type: C0402; RK PN: C1005X5R1A105K050BB
C5003 = CAP NP: cap,100.00pF,+/-10%,50V,C0G,C0402; Part Reference: C5003; Manufacturer: TDK; Value: 100pF; Number: 37; RK PN: C1005C0G1H101K050BA; Priority: A; Tolerance: 10%; C_Voltage: 10V; PCB Footprint: C0402; Part Type: C0402; Manufacturer PN: C1005C0G1H101K050BA; Created by: JJJ
C5005 = CAP NP: cap,100.00pF,+/-10%,50V,C0G,C0402; Part Reference: C5005; Manufacturer: TDK; Value: 100pF; Number: 37; RK PN: C1005C0G1H101K050BA; Priority: A; Tolerance: 10%; C_Voltage: 10V; PCB Footprint: C0402; Part Type: C0402; Manufacturer PN: C1005C0G1H101K050BA; Created by: JJJ
D5000 = DIODE: Schottky BarrierЈ¬B5819WS SOD-323; Part Reference: D5000; Manufacturer: і¤µз; Priority: A; PCB Footprint: SOD_323; Value: B5819WS; RK PN: B5819WS; Part Type: Schottky rectifier; Manufacturer PN: B5819WS; Created by: JJJ
D5002 = DIODE: Schottky BarrierЈ¬B5819W SOD-123; Part Reference: D5002; Manufacturer: і¤µз; Value: B5819W; Priority: A; PCB Footprint: SOD_123; RK PN: B5819W; Part Type: Schottky rectifier; Manufacturer PN: B5819W; Created by: JJJ
D5003 = DIODE: Schottky BarrierЈ¬B5819WS SOD-323; Part Reference: D5003; Manufacturer: і¤µз; Priority: A; PCB Footprint: SOD_323; Value: B5819WS; RK PN: B5819WS; Part Type: Schottky rectifier; Manufacturer PN: B5819WS; Created by: JJJ
D5005 = DIODE: Schottky BarrierЈ¬B5819W SOD-123; Part Reference: D5005; Manufacturer: і¤µз; Value: B5819W; Priority: A; PCB Footprint: SOD_123; RK PN: B5819W; Part Type: Schottky rectifier; Manufacturer PN: B5819W; Created by: JJJ
ED5000 = ESD_ESD5304D: 4-Lines, Uni-directional, Ultra-low Capacitance Transient Voltage Suppressors; Part Reference: ED5000; Manufacturer: WillSemi(О¤¶ы°лµјМе); Value: ESD73034D; Priority: A; PCB Footprint: SON10_2R50X1R00X0R50; RK PN: ESD5304D; Part Type: ESD_TVS; Manufacturer PN: ESD5304D; Created by: JJJ
ED5001 = ESD_ESD5304D: 4-Lines, Uni-directional, Ultra-low Capacitance Transient Voltage Suppressors; Part Reference: ED5001; Manufacturer: WillSemi(О¤¶ы°лµјМе); Value: ESD73034D; Priority: A; PCB Footprint: SON10_2R50X1R00X0R50; Created by: JJJ; Manufacturer PN: ESD5304D; Part Type: ESD_TVS; RK PN: ESD5304D
ED5002 = DIODE BI_DIR TRIG: 1-Line, Bi-directional, Transient Voltage Suppressors.1pF.; Part Reference: ED5002; Manufacturer: WillSemi(О¤¶ы°лµјМе); Value: ESD5341N; Priority: A; PCB Footprint: ESD0402; Created by: JJJ; Manufacturer PN: ESD5341N; Part Type: ESD_TVS; RK PN: ESD5341N
ED5003 = DIODE BI_DIR TRIG: 1-Line, Bi-directional, Transient Voltage Suppressors.1pF.; Part Reference: ED5003; Manufacturer: WillSemi(О¤¶ы°лµјМе); Value: ESD5341N; Priority: A; PCB Footprint: ESD0402; Created by: JJJ; Manufacturer PN: ESD5341N; Part Type: ESD_TVS; RK PN: ESD5341N
ED5004 = DIODE BI_DIR TRIG: 1-Line, Bi-directional, Transient Voltage Suppressors.1pF.; Part Reference: ED5004; Manufacturer: WillSemi(О¤¶ы°лµјМе); Value: ESD5341N; Priority: A; PCB Footprint: ESD0402; Created by: JJJ; Manufacturer PN: ESD5341N; Part Type: ESD_TVS; RK PN: ESD5341N
ED5005 = DIODE BI_DIR TRIG: 1-Line, Bi-directional, Transient Voltage Suppressors.1pF.; Part Reference: ED5005; Manufacturer: WillSemi(О¤¶ы°лµјМе); Value: ESD5341N; Priority: A; PCB Footprint: ESD0402; Created by: JJJ; Manufacturer PN: ESD5341N; Part Type: ESD_TVS; RK PN: ESD5341N
ED5006 = ESD_ESD5304D: 4-Lines, Uni-directional, Ultra-low Capacitance Transient Voltage Suppressors; Part Reference: ED5006; Manufacturer: WillSemi(О¤¶ы°лµјМе); Value: ESD73034D; Priority: A; PCB Footprint: SON10_2R50X1R00X0R50; RK PN: ESD5304D; Part Type: ESD_TVS; Manufacturer PN: ESD5304D; Created by: JJJ
ED5007 = ESD_ESD5304D: 4-Lines, Uni-directional, Ultra-low Capacitance Transient Voltage Suppressors; Part Reference: ED5007; Manufacturer: WillSemi(О¤¶ы°лµјМе); Value: ESD73034D; Priority: A; PCB Footprint: SON10_2R50X1R00X0R50; Created by: JJJ; Manufacturer PN: ESD5304D; Part Type: ESD_TVS; RK PN: ESD5304D
ED5008 = DIODE BI_DIR TRIG: 1-Line, Bi-directional, Transient Voltage Suppressors.1pF.; Part Reference: ED5008; Manufacturer: WillSemi(О¤¶ы°лµјМе); Value: ESD5341N; Priority: A; PCB Footprint: ESD0402; RK PN: ESD5341N; Part Type: ESD_TVS; Manufacturer PN: ESD5341N; Created by: JJJ
ED5009 = DIODE BI_DIR TRIG: 1-Line, Bi-directional, Transient Voltage Suppressors.1pF.; Part Reference: ED5009; Manufacturer: WillSemi(О¤¶ы°лµјМе); Value: ESD5341N; Priority: A; PCB Footprint: ESD0402; RK PN: ESD5341N; Part Type: ESD_TVS; Manufacturer PN: ESD5341N; Created by: JJJ
ED5010 = DIODE BI_DIR TRIG: 1-Line, Bi-directional, Transient Voltage Suppressors.1pF.; Part Reference: ED5010; Manufacturer: WillSemi(О¤¶ы°лµјМе); Value: ESD5341N; Priority: A; PCB Footprint: ESD0402; RK PN: ESD5341N; Part Type: ESD_TVS; Manufacturer PN: ESD5341N; Created by: JJJ
ED5011 = DIODE BI_DIR TRIG: 1-Line, Bi-directional, Transient Voltage Suppressors.1pF.; Part Reference: ED5011; Manufacturer: WillSemi(О¤¶ы°лµјМе); Value: ESD5341N; Priority: A; PCB Footprint: ESD0402; RK PN: ESD5341N; Part Type: ESD_TVS; Manufacturer PN: ESD5341N; Created by: JJJ
J5000 = HDMI_TYPE_A_0: Part Reference: J5000; Value: HDMI_TYPE_A; PCB Footprint: hdmia19_hdmi_01a
J5001 = HDMI_TYPE_A_0: Part Reference: J5001; Value: HDMI_TYPE_A; PCB Footprint: hdmia19_hdmi_01a
Q5000 = MOSFET N: NMOS,2SK3018,SOT_323,Id=0.1A,Vds=30V; Part Reference: Q5000; Manufacturer: ROHM; Rds: 5ohm; Priority: A; Id_max: 0.1A; Vgs: 20V; VDS: 30V; Vgsth: 1.5V; Pd: 0.2W; Value: 2SK3018; RK PN: 2SK3018; Part Type: NMOS; Manufacturer PN: 2SK3018; Created by: JJJ
Q5001 = MOSFET N: NMOS,2SK3018,SOT_323,Id=0.1A,Vds=30V; Part Reference: Q5001; Manufacturer: ROHM; Rds: 5ohm; Priority: A; Id_max: 0.1A; Vgs: 20V; VDS: 30V; Vgsth: 1.5V; Pd: 0.2W; Value: 2SK3018; RK PN: 2SK3018; Part Type: NMOS; Manufacturer PN: 2SK3018; Created by: JJJ
Q5002 = MOSFET N: NMOS,2SK3018,SOT_323,Id=0.1A,Vds=30V; Part Reference: Q5002; Manufacturer: ROHM; Pd: 0.2W; Vgsth: 1.5V; VDS: 30V; Vgs: 20V; Id_max: 0.1A; Priority: A; Rds: 5ohm; Value: 2SK3018; Created by: JJJ; Manufacturer PN: 2SK3018; Part Type: NMOS; RK PN: 2SK3018
Q5003 = MOSFET N: NMOS,2SK3018,SOT_323,Id=0.1A,Vds=30V; Part Reference: Q5003; Manufacturer: ROHM; Rds: 5ohm; Priority: A; Id_max: 0.1A; Vgs: 20V; VDS: 30V; Vgsth: 1.5V; Pd: 0.2W; Value: 2SK3018; RK PN: 2SK3018; Part Type: NMOS; Manufacturer PN: 2SK3018; Created by: JJJ
Q5004 = MOSFET N: NMOS,2SK3018,SOT_323,Id=0.1A,Vds=30V; Part Reference: Q5004; Manufacturer: ROHM; Rds: 5ohm; Priority: A; Id_max: 0.1A; Vgs: 20V; VDS: 30V; Vgsth: 1.5V; Pd: 0.2W; Value: 2SK3018; RK PN: 2SK3018; Part Type: NMOS; Manufacturer PN: 2SK3018; Created by: JJJ
Q5005 = MOSFET N: NMOS,2SK3018,SOT_323,Id=0.1A,Vds=30V; Part Reference: Q5005; Manufacturer: ROHM; Rds: 5ohm; Priority: A; Id_max: 0.1A; Vgs: 20V; VDS: 30V; Vgsth: 1.5V; Pd: 0.2W; Value: 2SK3018; RK PN: 2SK3018; Part Type: NMOS; Manufacturer PN: 2SK3018; Created by: JJJ
Q5006 = NPN: S8050,SOT23; Part Reference: Q5006; Manufacturer PN: S8050_SOT23; Manufacturer: і¤µз; Pc: 0.3W; Vceo: 25V; Ic: 0.5A; Priority: A; PCB Footprint: SOT_23; Value: S8050; Created by: JJJ; Part Type: NPN; RK PN: S8050
Q5007 = NPN: S8050,SOT23; Part Reference: Q5007; Manufacturer PN: S8050_SOT23; Manufacturer: і¤µз; Pc: 0.3W; Vceo: 25V; Ic: 0.5A; Priority: A; PCB Footprint: SOT_23; Value: S8050; Created by: JJJ; Part Type: NPN; RK PN: S8050
Q5008 = NPN: S8050,SOT23; Part Reference: Q5008; Manufacturer PN: S8050_SOT23; Manufacturer: і¤µз; Pc: 0.3W; Vceo: 25V; Ic: 0.5A; Priority: A; PCB Footprint: SOT_23; Value: S8050; Created by: JJJ; Part Type: NPN; RK PN: S8050
Q5009 = NPN: S8050,SOT23; Part Reference: Q5009; Manufacturer PN: S8050_SOT23; Manufacturer: і¤µз; Pc: 0.3W; Vceo: 25V; Ic: 0.5A; Priority: A; PCB Footprint: SOT_23; Value: S8050; Created by: JJJ; Part Type: NPN; RK PN: S8050
R5000 = RESISTOR_Dup1: НЁУГєсД¤µзЧи,10K,+/-5%,R0402,1/16W.; Part Reference: R5000; Manufacturer: YAGEO; RK PN: RC0402JR-0710KL; Priority: A; Wattage: 1/16W; PCB Footprint: R0402; Value: 10K; Part Type: НЁУГєсД¤µзЧи; Manufacturer PN: RC0402JR-0710KL; Created by: YTL
R5001 = RESISTOR_Dup1: НЁУГєсД¤µзЧи,1K8,+/-5%,R0402,1/16W.; Part Reference: R5001; Manufacturer PN: RC0402JR-071K8L; Manufacturer: YAGEO; Value: 1.8K; Wattage: 1/16W; Priority: A; PCB Footprint: R0402; Created by: YTL; Part Type: НЁУГєсД¤µзЧи; RK PN: RC0402JR-071K8L
R5002 = RESISTOR_Dup1: НЁУГєсД¤µзЧи,10K,+/-5%,R0402,1/16W.; Part Reference: R5002; Manufacturer PN: RC0402JR-0710KL; Manufacturer: YAGEO; Wattage: 1/16W; Priority: A; PCB Footprint: R0402; Value: 10K; Created by: YTL; Part Type: НЁУГєсД¤µзЧи; RK PN: RC0402JR-0710KL
R5003 = RESISTOR_Dup1: НЁУГєсД¤µзЧи,22R,+/-5%,R0402,1/16W.; Part Reference: R5003; Manufacturer PN: RC0402JR-0722RL; Manufacturer: YAGEO; Wattage: 1/16W; Priority: A; PCB Footprint: R0402; Value: 22R; Created by: YTL; Part Type: НЁУГєсД¤µзЧи; RK PN: RC0402JR-0722RL
R5004 = RESISTOR_Dup1: НЁУГєсД¤µзЧи,1K2,+/-5%,R0402,1/16W.; Part Reference: R5004; Manufacturer: YAGEO; Value: 1.2K; RK PN: RC0402JR-071K2L; Priority: A; Wattage: 1/16W; PCB Footprint: R0402; Part Type: НЁУГєсД¤µзЧи; Manufacturer PN: RC0402JR-071K2L; Created by: YTL
R5005 = RESISTOR_Dup1: НЁУГєсД¤µзЧи,47K,+/-5%,R0402,1/16W.; Part Reference: R5005; Manufacturer PN: RC0402JR-0747KL; Manufacturer: YAGEO; Wattage: 1/16W; Priority: A; PCB Footprint: R0402; Value: 47K; Created by: YTL; Part Type: НЁУГєсД¤µзЧи; RK PN: RC0402JR-0747KL
R5006 = RESISTOR_Dup1: НЁУГєсД¤µзЧи,10K,+/-5%,R0402,1/16W.; Part Reference: R5006; Manufacturer PN: RC0402JR-0710KL; Manufacturer: YAGEO; Wattage: 1/16W; Priority: A; PCB Footprint: R0402; Value: 10K; Created by: YTL; Part Type: НЁУГєсД¤µзЧи; RK PN: RC0402JR-0710KL
R5007 = RESISTOR_Dup1: НЁУГєсД¤µзЧи,1K8,+/-5%,R0402,1/16W.; Part Reference: R5007; Manufacturer PN: RC0402JR-071K8L; Manufacturer: YAGEO; Value: 1.8K; Wattage: 1/16W; Priority: A; PCB Footprint: R0402; Created by: YTL; Part Type: НЁУГєсД¤µзЧи; RK PN: RC0402JR-071K8L
R5008 = RESISTOR_Dup1: НЁУГєсД¤µзЧи,22R,+/-5%,R0402,1/16W.; Part Reference: R5008; Manufacturer: YAGEO; RK PN: RC0402JR-0722RL; Priority: A; Wattage: 1/16W; PCB Footprint: R0402; Value: 22R; Part Type: НЁУГєсД¤µзЧи; Manufacturer PN: RC0402JR-0722RL; Created by: YTL
R5009 = RESISTOR_Dup1: НЁУГєсД¤µзЧи,27K,+/-5%,R0402,1/16W.; Part Reference: R5009; Manufacturer PN: RC0402JR-0727KL; Manufacturer: YAGEO; Wattage: 1/16W; Priority: A; PCB Footprint: R0402; Value: 27K; Created by: YTL; Part Type: НЁУГєсД¤µзЧи; RK PN: RC0402JR-0727KL
R5010 = RESISTOR_Dup1: НЁУГєсД¤µзЧи,0R,+/-5%,R0402,1/16W.; Part Reference: R5010; Manufacturer: YAGEO; RK PN: RC0402JR-070RL; Priority: A; Wattage: 1/16W; PCB Footprint: R0402; Value: 0R; Part Type: НЁУГєсД¤µзЧи; Manufacturer PN: RC0402JR-070RL; Created by: YTL
R5011 = RESISTOR_Dup1: НЁУГєсД¤µзЧи,22R,+/-5%,R0402,1/16W.; Part Reference: R5011; Manufacturer PN: RC0402JR-0722RL; Manufacturer: YAGEO; Wattage: 1/16W; Priority: A; PCB Footprint: R0402; Value: 22R; Created by: YTL; Part Type: НЁУГєсД¤µзЧи; RK PN: RC0402JR-0722RL
R5012 = RESISTOR_Dup1: НЁУГєсД¤µзЧи,10K,+/-5%,R0402,1/16W.; Part Reference: R5012; Manufacturer PN: RC0402JR-0710KL; Manufacturer: YAGEO; Wattage: 1/16W; Priority: A; PCB Footprint: R0402; Value: 10K; Created by: YTL; Part Type: НЁУГєсД¤µзЧи; RK PN: RC0402JR-0710KL
R5013 = RESISTOR_Dup1: НЁУГєсД¤µзЧи,1K8,+/-5%,R0402,1/16W.; Part Reference: R5013; Manufacturer PN: RC0402JR-071K8L; Manufacturer: YAGEO; Value: 1.8K; Wattage: 1/16W; Priority: A; PCB Footprint: R0402; Created by: YTL; Part Type: НЁУГєсД¤µзЧи; RK PN: RC0402JR-071K8L
R5014 = RESISTOR_Dup1: НЁУГєсД¤µзЧи,10K,+/-5%,R0402,1/16W.; Part Reference: R5014; Manufacturer: YAGEO; RK PN: RC0402JR-0710KL; Priority: A; Wattage: 1/16W; PCB Footprint: R0402; Value: 10K; Part Type: НЁУГєсД¤µзЧи; Manufacturer PN: RC0402JR-0710KL; Created by: YTL
R5015 = RESISTOR_Dup1: НЁУГєсД¤µзЧи,22R,+/-5%,R0402,1/16W.; Part Reference: R5015; Manufacturer: YAGEO; RK PN: RC0402JR-0722RL; Priority: A; Wattage: 1/16W; PCB Footprint: R0402; Value: 22R; Part Type: НЁУГєсД¤µзЧи; Manufacturer PN: RC0402JR-0722RL; Created by: YTL
R5016 = RESISTOR_Dup1: НЁУГєсД¤µзЧи,1K2,+/-5%,R0402,1/16W.; Part Reference: R5016; Manufacturer: YAGEO; Value: 1.2K; RK PN: RC0402JR-071K2L; Priority: A; Wattage: 1/16W; PCB Footprint: R0402; Part Type: НЁУГєсД¤µзЧи; Manufacturer PN: RC0402JR-071K2L; Created by: YTL
R5017 = RESISTOR_Dup1: НЁУГєсД¤µзЧи,47K,+/-5%,R0402,1/16W.; Part Reference: R5017; Manufacturer PN: RC0402JR-0747KL; Manufacturer: YAGEO; Wattage: 1/16W; Priority: A; PCB Footprint: R0402; Value: 47K; Created by: YTL; Part Type: НЁУГєсД¤µзЧи; RK PN: RC0402JR-0747KL
R5018 = RESISTOR_Dup1: НЁУГєсД¤µзЧи,10K,+/-5%,R0402,1/16W.; Part Reference: R5018; Manufacturer: YAGEO; RK PN: RC0402JR-0710KL; Priority: A; Wattage: 1/16W; PCB Footprint: R0402; Value: 10K; Part Type: НЁУГєсД¤µзЧи; Manufacturer PN: RC0402JR-0710KL; Created by: YTL
R5019 = RESISTOR_Dup1: НЁУГєсД¤µзЧи,1K8,+/-5%,R0402,1/16W.; Part Reference: R5019; Manufacturer: YAGEO; Value: 1.8K; RK PN: RC0402JR-071K8L; Priority: A; Wattage: 1/16W; PCB Footprint: R0402; Part Type: НЁУГєсД¤µзЧи; Manufacturer PN: RC0402JR-071K8L; Created by: YTL
R5020 = RESISTOR_Dup1: НЁУГєсД¤µзЧи,22R,+/-5%,R0402,1/16W.; Part Reference: R5020; Manufacturer PN: RC0402JR-0722RL; Manufacturer: YAGEO; Wattage: 1/16W; Priority: A; PCB Footprint: R0402; Value: 22R; Created by: YTL; Part Type: НЁУГєсД¤µзЧи; RK PN: RC0402JR-0722RL
R5021 = RESISTOR_Dup1: НЁУГєсД¤µзЧи,27K,+/-5%,R0402,1/16W.; Part Reference: R5021; Manufacturer PN: RC0402JR-0727KL; Manufacturer: YAGEO; Wattage: 1/16W; Priority: A; PCB Footprint: R0402; Value: 27K; Created by: YTL; Part Type: НЁУГєсД¤µзЧи; RK PN: RC0402JR-0727KL
R5022 = RESISTOR_Dup1: НЁУГєсД¤µзЧи,0R,+/-5%,R0402,1/16W.; Part Reference: R5022; Manufacturer: YAGEO; RK PN: RC0402JR-070RL; Priority: A; Wattage: 1/16W; PCB Footprint: R0402; Value: 0R; Part Type: НЁУГєсД¤µзЧи; Manufacturer PN: RC0402JR-070RL; Created by: YTL
R5023 = RESISTOR_Dup1: НЁУГєсД¤µзЧи,22R,+/-5%,R0402,1/16W.; Part Reference: R5023; Manufacturer: YAGEO; RK PN: RC0402JR-0722RL; Priority: A; Wattage: 1/16W; PCB Footprint: R0402; Value: 22R; Part Type: НЁУГєсД¤µзЧи; Manufacturer PN: RC0402JR-0722RL; Created by: YTL
R5025 = RESISTOR_Dup1: НЁУГєсД¤µзЧи,1K,+/-5%,R0402,1/16W.; Part Reference: R5025; Manufacturer PN: RC0402JR-071KL; Manufacturer: YAGEO; Wattage: 1/16W; Priority: A; PCB Footprint: R0402; Value: 1K; Created by: YTL; Part Type: НЁУГєсД¤µзЧи; RK PN: RC0402JR-071KL
R5026 = RESISTOR_Dup1: НЁУГєсД¤µзЧи,1K,+/-5%,R0402,1/16W.; Part Reference: R5026; Manufacturer PN: RC0402JR-071KL; Manufacturer: YAGEO; Wattage: 1/16W; Priority: A; PCB Footprint: R0402; Value: 1K; Created by: YTL; Part Type: НЁУГєсД¤µзЧи; RK PN: RC0402JR-071KL
R5027 = RESISTOR_Dup1: НЁУГєсД¤µзЧи,47K,+/-5%,R0402,1/16W.; Part Reference: R5027; Manufacturer PN: RC0402JR-0747KL; Manufacturer: YAGEO; Wattage: 1/16W; Priority: A; PCB Footprint: R0402; Value: 47K; Created by: YTL; Part Type: НЁУГєсД¤µзЧи; RK PN: RC0402JR-0747KL
R5028 = RESISTOR_Dup1: НЁУГєсД¤µзЧи,47K,+/-5%,R0402,1/16W.; Part Reference: R5028; Manufacturer PN: RC0402JR-0747KL; Manufacturer: YAGEO; Wattage: 1/16W; Priority: A; PCB Footprint: R0402; Value: 47K; Created by: YTL; Part Type: НЁУГєсД¤µзЧи; RK PN: RC0402JR-0747KL